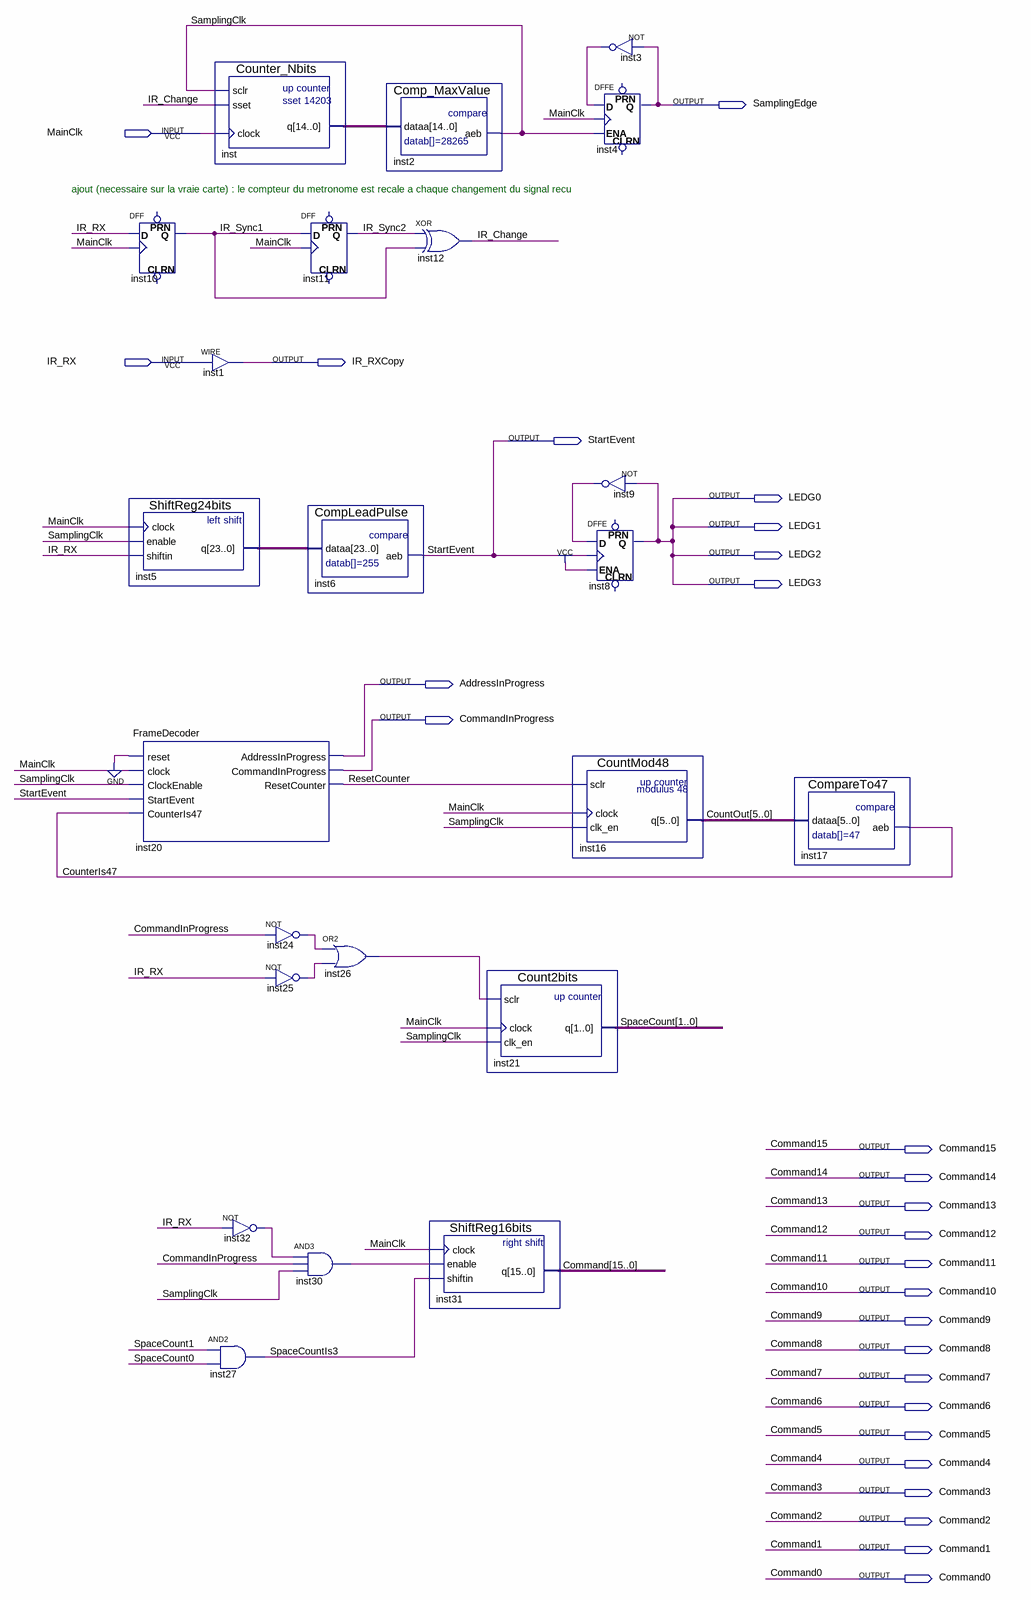
[diagram p0: schematic sheet]
// Quartus schematic DecodeurIR.bdf as structural Verilog: 23 symbols, 27 pins
module DecodeurIR (
  input  MainClk,
  input  IR_RX,
  output SamplingEdge,
  output IR_RXCopy,
  output StartEvent,
  output LEDG0,
  output LEDG1,
  output LEDG2,
  output LEDG3,
  output AddressInProgress,
  output CommandInProgress,
  output Command15,
  output Command14,
  output Command13,
  output Command12,
  output Command11,
  output Command10,
  output Command9,
  output Command8,
  output Command7,
  output Command6,
  output Command5,
  output Command4,
  output Command3,
  output Command2,
  output Command1,
  output Command0
);

  wire CounterIs47, inst3_out, inst9_out, inst24_out, inst25_out, inst26_out, inst30_out, inst32_out,
       IR_Change, IR_Sync1, IR_Sync2, ResetCounter, SamplingClk, SpaceCountIs3;
  wire [1:0] SpaceCount;
  wire [5:0] CountOut;
  wire [14:0] inst_q;
  wire [23:0] inst5_q;

  DFF inst10 (.CLK(MainClk), .D(IR_RX), .Q(IR_Sync1));  // open: CLRN, PRN
  ShiftReg24bits inst5 (.clock(MainClk), .enable(SamplingClk), .shiftin(IR_RX), .q(inst5_q));
  FrameDecoder inst20 (
    .reset(1'b0), .clock(MainClk), .ClockEnable(SamplingClk), .StartEvent(StartEvent),
    .CounterIs47(CounterIs47), .AddressInProgress(AddressInProgress), .CommandInProgress(CommandInProgress),
    .ResetCounter(ResetCounter));
  assign IR_RXCopy = IR_RX;  // WIRE inst1
  and inst27 (SpaceCountIs3, SpaceCount[1], SpaceCount[0]);
  Counter_Nbits inst (.sclr(SamplingClk), .sset(IR_Change), .clock(MainClk), .q(inst_q));
  not inst24 (inst24_out, CommandInProgress);
  not inst25 (inst25_out, IR_RX);
  not inst32 (inst32_out, IR_RX);
  DFF inst11 (.CLK(MainClk), .D(IR_Sync1), .Q(IR_Sync2));  // open: CLRN, PRN
  CompLeadPulse inst6 (.dataa(inst5_q), .aeb(StartEvent));
  or inst26 (inst26_out, inst24_out, inst25_out);
  and inst30 (inst30_out, inst32_out, CommandInProgress, SamplingClk);
  Comp_MaxValue inst2 (.dataa(inst_q), .aeb(SamplingClk));
  xor inst12 (IR_Change, IR_Sync2, IR_Sync1);
  ShiftReg16bits inst31 (
    .clock(MainClk), .enable(inst30_out), .shiftin(SpaceCountIs3),
    .q({Command15, Command14, Command13, Command12, Command11, Command10, Command9, Command8, Command7, Command6, Command5, Command4, Command3, Command2, Command1, Command0}));
  Count2bits inst21 (.sclr(inst26_out), .clock(MainClk), .clk_en(SamplingClk), .q(SpaceCount));
  not inst3 (inst3_out, SamplingEdge);
  DFFE inst4 (.D(inst3_out), .CLK(MainClk), .ENA(SamplingClk), .Q(SamplingEdge));  // open: PRN, CLRN
  not inst9 (inst9_out, LEDG0);
  DFFE inst8 (.D(inst9_out), .CLK(StartEvent), .ENA(1'b1), .Q(LEDG0));  // open: PRN, CLRN
  CountMod48 inst16 (.sclr(ResetCounter), .clock(MainClk), .clk_en(SamplingClk), .q(CountOut));
  CompareTo47 inst17 (.dataa(CountOut), .aeb(CounterIs47));

  assign LEDG1 = LEDG0;
  assign LEDG2 = LEDG0;
  assign LEDG3 = LEDG0;

  // Notes on the sheet:
  //   ajout (necessaire sur la vraie carte) : le compteur du metronome est recale a chaque changement du signal recu
endmodule
